# Altium schematic sheet Off Board.SchDoc
size A4
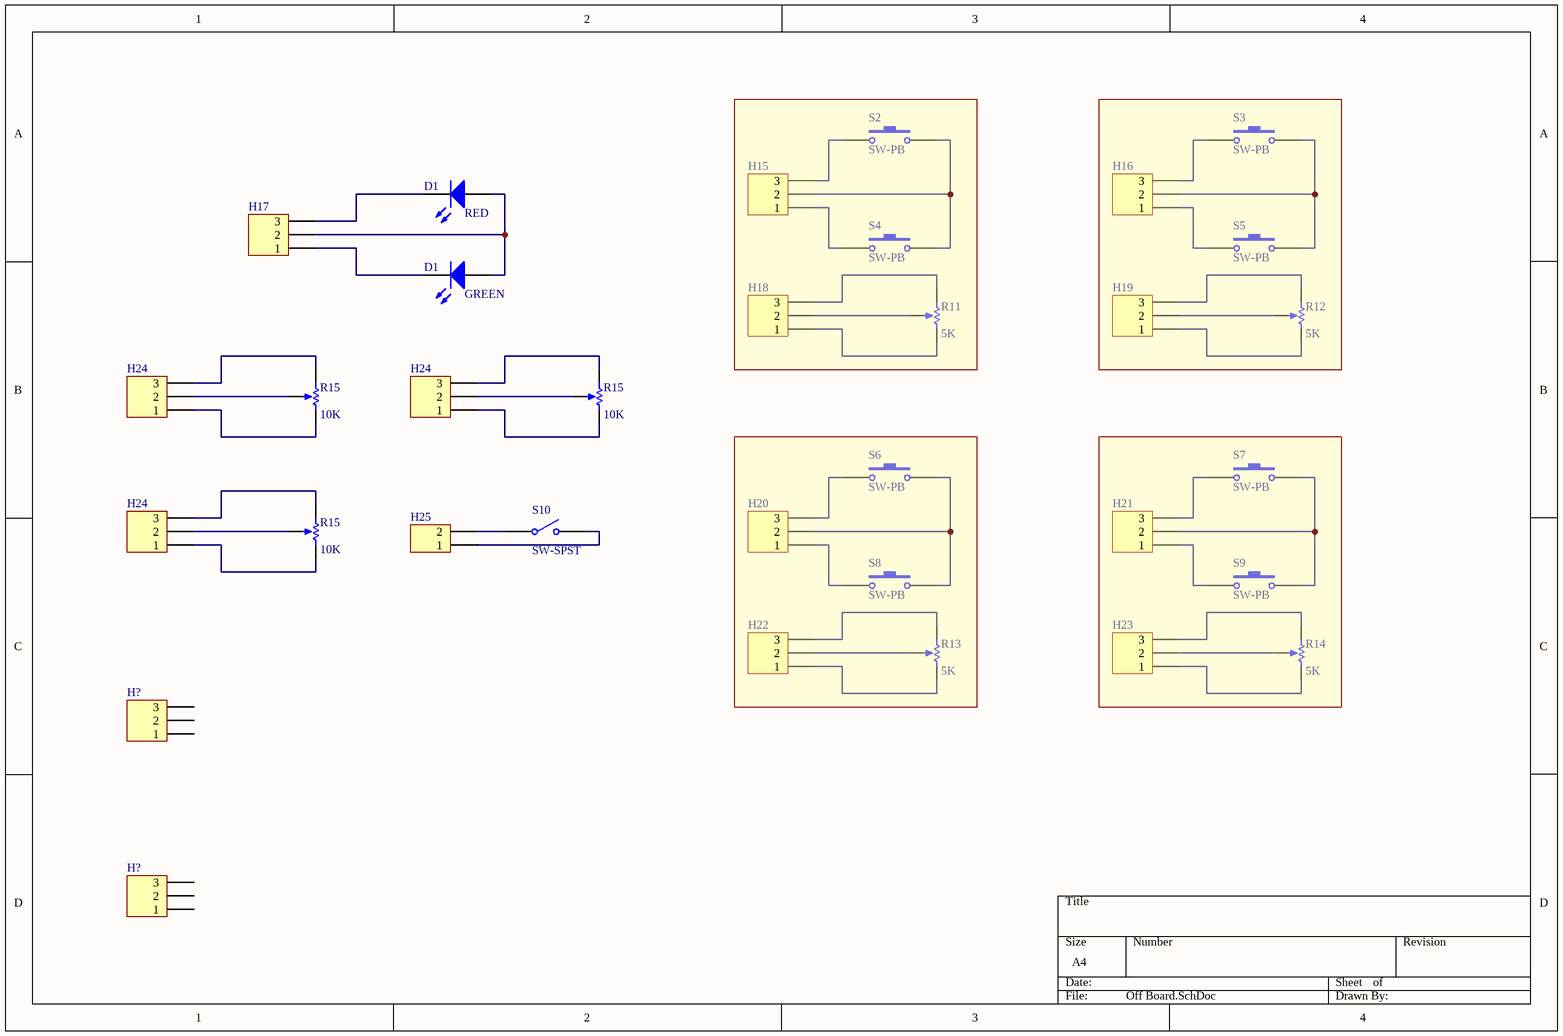
[diagram p0: Off Board.SchDoc]

## Parts
(Parts that share a designator on the sheet are numbered #1, #2 ... from top to bottom, then left to right.)
D1#1  RED  [LED-1]
D1#2  GREEN  [LED-1]
H15  Header 3  [HDR1X3]  (value not drawn)
H16  Header 3  [HDR1X3]  (value not drawn)
H17  Header 3  [HDR1X3]  (value not drawn)
H18  Header 3  [HDR1X3]  (value not drawn)
H19  Header 3  [HDR1X3]  (value not drawn)
H20  Header 3  [HDR1X3]  (value not drawn)
H21  Header 3  [HDR1X3]  (value not drawn)
H22  Header 3  [HDR1X3]  (value not drawn)
H23  Header 3  [HDR1X3]  (value not drawn)
H24#1  Header 3  [HDR1X3]  (value not drawn)
H24#2  Header 3  [HDR1X3]  (value not drawn)
H24#3  Header 3  [HDR1X3]  (value not drawn)
H25  Header 2  [HDR1X2]  (value not drawn)
H?#1  Header 3  [HDR1X3]  (value not drawn)
H?#2  Header 3  [HDR1X3]  (value not drawn)
R11  value 5K  [RES_TRIM_200]  (hidden comment: RPot)
R12  value 5K  [RES_TRIM_200]  (hidden comment: RPot)
R13  value 5K  [RES_TRIM_200]  (hidden comment: RPot)
R14  value 5K  [RES_TRIM_200]  (hidden comment: RPot)
R15#1  value 10K  [RES_TRIM_200]  (hidden comment: RPot)
R15#2  value 10K  [RES_TRIM_200]  (hidden comment: RPot)
R15#3  value 10K  [RES_TRIM_200]  (hidden comment: RPot)
S2  SW-PB  [SPST-2]
S3  SW-PB  [SPST-2]
S4  SW-PB  [SPST-2]
S5  SW-PB  [SPST-2]
S6  SW-PB  [SPST-2]
S7  SW-PB  [SPST-2]
S8  SW-PB  [SPST-2]
S9  SW-PB  [SPST-2]
S10  SW-SPST  [SPST-2]

## Nets
NetD1#1_1: D1#1.1(A) D1#2.1(A) H17.2
NetD1#1_2: D1#1.2(K) H17.3
NetD1#2_2: D1#2.2(K) H17.1
NetH15_1: H15.1 S4.1
NetH15_2: H15.2 S2.2 S4.2
NetH15_3: H15.3 S2.1
NetH16_1: H16.1 S5.1
NetH16_2: H16.2 S3.2 S5.2
NetH16_3: H16.3 S3.1
NetH18_1: H18.1 R11.2(BOT)
NetH18_2: H18.2 R11.3(TAP)
NetH18_3: H18.3 R11.1(TOP)
NetH19_1: H19.1 R12.2(BOT)
NetH19_2: H19.2 R12.3(TAP)
NetH19_3: H19.3 R12.1(TOP)
NetH20_1: H20.1 S8.1
NetH20_2: H20.2 S6.2 S8.2
NetH20_3: H20.3 S6.1
NetH21_1: H21.1 S9.1
NetH21_2: H21.2 S7.2 S9.2
NetH21_3: H21.3 S7.1
NetH22_1: H22.1 R13.2(BOT)
NetH22_2: H22.2 R13.3(TAP)
NetH22_3: H22.3 R13.1(TOP)
NetH23_1: H23.1 R14.2(BOT)
NetH23_2: H23.2 R14.3(TAP)
NetH23_3: H23.3 R14.1(TOP)
NetH24#1_1: H24#1.1 R15#1.2(BOT)
NetH24#1_2: H24#1.2 R15#1.3(TAP)
NetH24#1_3: H24#1.3 R15#1.1(TOP)
NetH24#2_1: H24#2.1 R15#2.2(BOT)
NetH24#2_2: H24#2.2 R15#2.3(TAP)
NetH24#2_3: H24#2.3 R15#2.1(TOP)
NetH24#3_1: H24#3.1 R15#3.2(BOT)
NetH24#3_2: H24#3.2 R15#3.3(TAP)
NetH24#3_3: H24#3.3 R15#3.1(TOP)
NetH25_1: H25.1 S10.2(NO)
NetH25_2: H25.2 S10.1(COMMON)

Not connected (* = marked no-connect by the designer): H?#1 1 2 3; H?#2 1 2 3

## Library data of the parts
D1#1 D1#2 = LED1: Typical RED GaAs LED; Published: 8-Jun-2000; LatestRevisionDate: 08-Jul-2005; LatestRevisionNote: Mech Layer 1 removed.; PackageReference: LED-1; Publisher: Altium Limited; PackageDescription: LED; 2 Leads
H15-H23 H24#1-H24#3 H?#1 H?#2 = Header 3: Header, 3-Pin; Manufacturer: Generic Components; Class: Connector
H25 = Header 2: Header, 2-Pin; Manufacturer: Generic Components; Class: Connector
R11-R14 R15#1-R15#3 = RPot: Potentiometer; Manufacturer: Generic Components; Class: Passive; Set Position: 0.5; Published: 08/06/2000; Publisher: Altium Hobart Technology Centre; SubClass: Potentiometer
S2-S9 = SW-PB: Switch; Published: 24-Mar-1999; LatestRevisionDate: 17-Jul-2002; LatestRevisionNote: Re-released for DXP Platform.; PackageReference: SPST-2; Publisher: Altium Limited; PackageDescription: Switch; 2 Leads
S10 = SW-SPST: Single-Pole, Single-Throw Switch; Published: 24-Mar-1999; LatestRevisionDate: 17-Jul-2002; LatestRevisionNote: Re-released for DXP Platform.; PackageReference: SPST-2; Publisher: Altium Limited; PackageDescription: Switch; 2 Leads